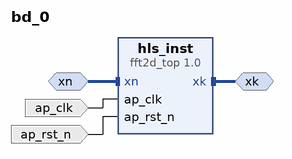
[diagram p0: block diagram of the top level]
# Vivado block design bd_0, xczu7ev-ffvc1156-2-e, Vivado 2019.1
create_bd_design bd_0

create_bd_intf_port -mode Master -vlnv xilinx.com:interface:axis_rtl:1.0 xk
set_property -dict {CONFIG.FREQ_HZ 400000000.0} [get_bd_intf_ports xk]
create_bd_intf_port -mode Slave -vlnv xilinx.com:interface:axis_rtl:1.0 xn
set_property -dict [list \
  CONFIG.FREQ_HZ 400000000.0 \
  CONFIG.HAS_TKEEP 0 \
  CONFIG.HAS_TLAST 1 \
  CONFIG.HAS_TREADY 1 \
  CONFIG.HAS_TSTRB 0 \
  CONFIG.LAYERED_METADATA undef \
  CONFIG.TDATA_NUM_BYTES 8 \
  CONFIG.TDEST_WIDTH 0 \
  CONFIG.TID_WIDTH 0 \
  CONFIG.TUSER_WIDTH 0 \
] [get_bd_intf_ports xn]
create_bd_port -dir I -type clk ap_clk
set_property -dict {CONFIG.FREQ_HZ 400000000.0} [get_bd_ports ap_clk]
create_bd_port -dir I -type rst ap_rst_n

create_bd_cell -type ip -vlnv EA:hls:fft2d_top:1.0 hls_inst

# ---- connections ----

connect_bd_intf_net -intf_net xn_0_1 [get_bd_intf_ports xn] [get_bd_intf_pins hls_inst/xn]
connect_bd_intf_net [get_bd_intf_ports xk] [get_bd_intf_pins hls_inst/xk]
connect_bd_net -net ap_clk_0_1 [get_bd_ports ap_clk] [get_bd_pins hls_inst/ap_clk]
connect_bd_net -net ap_rst_n_0_1 [get_bd_ports ap_rst_n] [get_bd_pins hls_inst/ap_rst_n]

validate_bd_design
save_bd_design
